# Altium schematic sheet FLOLED.SchDoc
size 203 x 127 mm; SheetNumber: 1; SheetTotal: 1
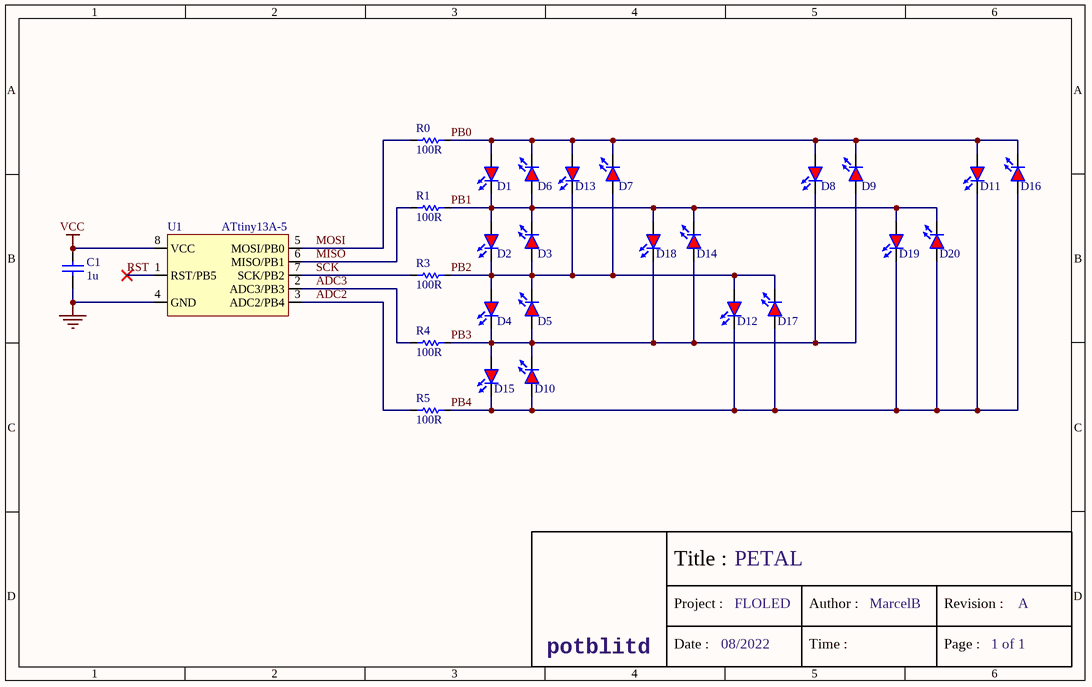
[diagram p0: FLOLED.SchDoc]

## Parts
C1  value 1u  [0603C]  (hidden comment: Capacitor)
D1  LED Red  [0805D]  (value not drawn)
D2  LED Red  [0805D]  (value not drawn)
D3  LED Red  [0805D]  (value not drawn)
D4  LED Red  [0805D]  (value not drawn)
D5  LED Red  [0805D]  (value not drawn)
D6  LED Red  [0805D]  (value not drawn)
D7  LED Red  [0805D]  (value not drawn)
D8  LED Red  [0805D]  (value not drawn)
D9  LED Red  [0805D]  (value not drawn)
D10  LED Red  [0805D]  (value not drawn)
D11  LED Red  [0805D]  (value not drawn)
D12  LED Red  [0805D]  (value not drawn)
D13  LED Red  [0805D]  (value not drawn)
D14  LED Red  [0805D]  (value not drawn)
D15  LED Red  [0805D]  (value not drawn)
D16  LED Red  [0805D]  (value not drawn)
D17  LED Red  [0805D]  (value not drawn)
D18  LED Red  [0805D]  (value not drawn)
D19  LED Red  [0805D]  (value not drawn)
D20  LED Red  [0805D]  (value not drawn)
R0  value 100R  [0805R]  (hidden comment: Resistor)
R1  value 100R  [0805R]  (hidden comment: Resistor)
R3  value 100R  [0805R]  (hidden comment: Resistor)
R4  value 100R  [0805R]  (hidden comment: Resistor)
R5  value 100R  [0805R]  (hidden comment: Resistor)
U1  ATtiny13A-5  [DIP-8 - SMD]

## Nets
GND: C1.1 U1.4(GND)
VCC: C1.2 U1.8(VCC)
ADC2: R5.1 U1.3(ADC2/PB4)
ADC3: R4.1 U1.2(ADC3/PB3)
MISO: R1.1 U1.6(MISO/PB1)
MOSI: R0.1 U1.5(MOSI/PB0)
PB0: D1.1 D6.2 D7.2 D8.1 D9.2 D11.1 D13.1 D16.2 R0.2
PB1: D1.2 D2.1 D3.2 D6.1 D14.2 D18.1 D19.1 D20.2 R1.2
PB2: D2.2 D3.1 D4.1 D5.2 D7.1 D12.1 D13.2 D17.2 R3.2
PB3: D4.2 D5.1 D8.2 D9.1 D10.2 D14.1 D15.1 D18.2 R4.2
PB4: D10.1 D11.2 D12.2 D15.2 D16.1 D17.1 D19.2 D20.1 R5.2
RST: U1.1(RST/PB5)
SCK: R3.1 U1.7(SCK/PB2)

## Notes on the sheet
- Title :
- PETAL
- Project :
- FLOLED
- Author :
- MarcelB
- Revision :
- A
- potblitd
- Date :
- 08/2022
- Time :
- Page :
- 1 of 1

## Library data of the parts
C1 = Capacitor: Capacitor 1uF; Value: 1uF
D1-D20 = LED-R: Red LED Vf=2.1V Ic=20mA; Value: 2.1V
R0 R1 R3-R5 = RES: Resistor 100Ω
U1 = ATtiny13A-5: tiny AVR 8-pin microcontroller; Value: 13A